# EAGLE schematic uvmeter (EAGLE 7.3.0)
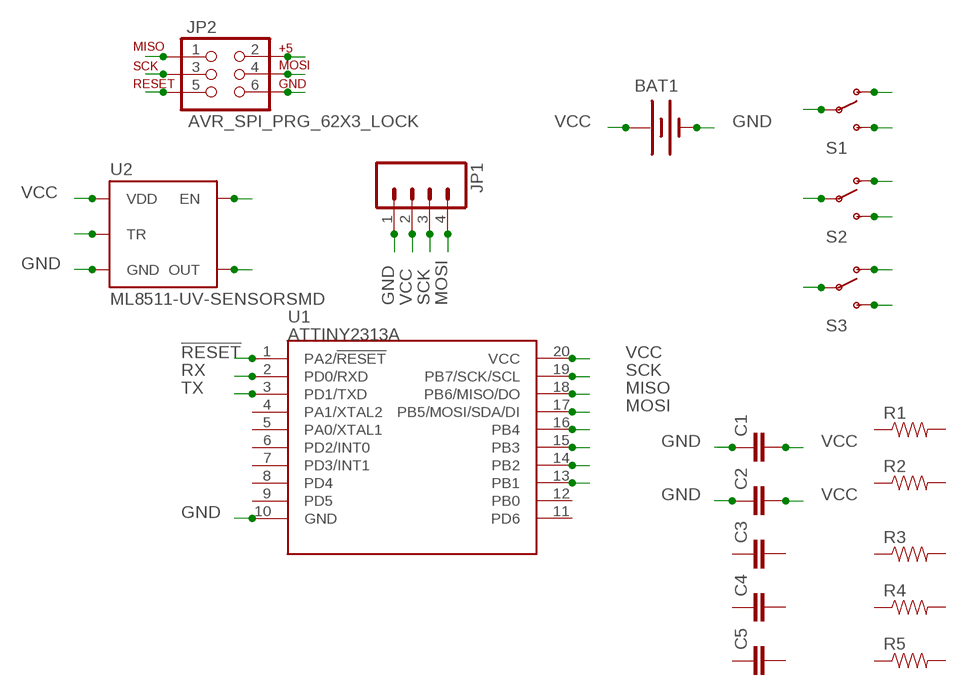
[diagram p0: schematic, sheet 1]

## Parts
BAT1  BATTERY20SMD  [BATTCON_20MM]
C1  CAP0805  [0805]
C2  CAP0805  [0805]
C3  CAP0805  [0805]
C4  CAP0805  [0805]
C5  CAP0805  [0805]
JP1  M04LONGPADS  [1X04_LONGPADS]
JP2  AVR_SPI_PRG_62X3_LOCK  [2X3_LOCK]
R1  RESISTOR0805-RES  [0805]
R2  RESISTOR0805-RES  [0805]
R3  RESISTOR0805-RES  [0805]
R4  RESISTOR0805-RES  [0805]
R5  RESISTOR0805-RES  [0805]
S1  SWITCH-SPDTSMD2  [SWITCH-SPDT-SMD]
S2  SWITCH-SPDTSMD2  [SWITCH-SPDT-SMD]
S3  SWITCH-SPDTSMD2  [SWITCH-SPDT-SMD]
U1  ATTINY2313A  [SOP20W]
U2  ML8511-UV-SENSORSMD  [ML8511]

## Nets
!RESET: JP2.5 U1.1(PA2/!RESET)
GND: BAT1.2(-) C1.1 C2.1 JP1.1 JP2.6 U1.10(GND) U2.5(GND)
MISO: JP2.1 U1.18(PB6/MISO/DO)
MOSI: JP1.4 JP2.4 U1.17(PB5/MOSI/SDA/DI)
N$1: U1.13(PB1)
N$2: U2.10(TR)
N$5: U2.8(OUT)
N$6: U2.4(EN)
N$9: U1.16(PB4)
N$10: U1.15(PB3)
N$11: U1.14(PB2)
N$18: S1.2(P)
N$19: S2.2(P)
N$20: S3.2(P)
N$21: S1.1(O)
N$22: S1.3(S)
N$23: S2.1(O)
N$24: S2.3(S)
N$25: S3.1(O)
N$26: S3.3(S)
RX: U1.2(PD0/RXD)
SCK: JP1.3 JP2.3 U1.19(PB7/SCK/SCL)
TX: U1.3(PD1/TXD)
VCC: BAT1.1(+) C1.2 C2.2 JP1.2 JP2.2 U1.20(VCC) U2.7(VDD)
Unconnected: C3.1 C3.2 C4.1 C4.2 C5.1 C5.2 R1.1 R1.2 R2.1 R2.2 R3.1 R3.2 R4.1 R4.2 R5.1 R5.2 U1.4(PA1/XTAL2) U1.5(PA0/XTAL1) U1.6(PD2/INT0) U1.7(PD3/INT1) U1.8(PD4) U1.9(PD5) U1.11(PD6) U1.12(PB0)

## Library data of the parts
BAT1 = SparkFun-Electromechanical:BATTERY: Battery Holders Various common sizes : AA, AAA, 18650 (PRT-12895), 20mm coin cell and 12mm coin cell. 20MM_4LEGS, BATT-10373
C1-C5 = SparkFun-Capacitors:CAP: Capacitor Standard 0603 ceramic capacitor, and 0.1" leaded capacitor.
JP1 = SparkFun-Connectors:M04: Header 4 Standard 4-pin 0.1" header. Use with straight break away headers (SKU : PRT-00116), right angle break away headers (PRT-00553), swiss pins (PRT-00743), machine pins (PRT-00117), and female headers (PRT-00115). Molex polarized connector foot print use with SKU : PRT-08231 with associated crimp pins and housings. 1MM SMD Version SKU: PRT-10208
JP2 = SparkFun-Connectors:AVR_SPI_PRG_6: AVR ISP 6 Pin This is the reduced ISP connector for AVR programming. Common on Arduino. This footprint will take up less PCB space and can be used with a 10-pin to 6-pin adapter such as SKU: BOB-08508 **Special note about "TEST_POINT" package. The stop mask is on the top side, so if you want your programming test points to be on the bottom of your board, make sure to place this package on the bottom side of the board. This also ensure that the orientation to program from the bottom side will be correct.
R1-R5 = SparkFun-Resistors:RESISTOR: Resistor Basic schematic elements and footprints for 0603, 1206, and PTH resistors.
S1-S3 = SparkFun-Electromechanical:SWITCH-SPDT: SPDT Switch Simple slide switch, Spark Fun Electronics SKU : COM-00102 DPDT SMT slide switch, AYZ0202, SWCH-08179
U1 = SparkFun-DigitalIC:ATTINY2313A: ATTINY2313A 2kB 20MHz I2C/SPI/UART; PROD_ID: IC-11305
U2 = SparkFun-Sensors:ML8511-UV-SENSOR; PROD_ID: IC-11927